# Altium schematic sheet Flash.SchDoc
size A4; SheetNumber: 5; SheetTotal: 8
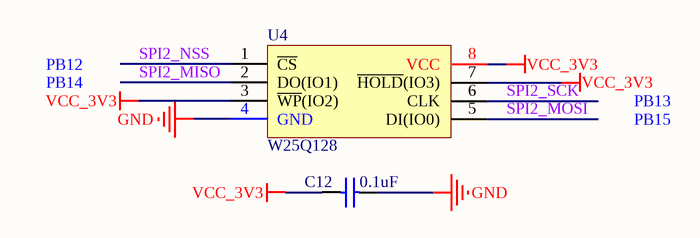
[diagram p0: Flash.SchDoc]

## Parts
C12  0.1uF  [C0402_L]
U4  W25Q128  [WSON 6x5mm]

## Nets
GND: C12.1 U4.4(GND)
VCC_3V3: C12.2 U4.3(~{WP}(IO2)) U4.7(~{HOLD}(IO3)) U4.8(VCC)
SPI2_MISO: U4.2(DO(IO1))
SPI2_MOSI: U4.5(DI(IO0))
SPI2_NSS: U4.1(~{CS})
SPI2_SCK: U4.6(CLK)

## Notes on the sheet
- PB14
- PB12
- PB15
- PB13

## Library data of the parts
C12 = C: 贴片电容; BOM名称: 无极性贴片电容; 联系卖家，免费查找封装: 唯一出售店铺网址https://shop463601444.taobao.com
U4 = W25Qxx: SPI Flash